# EAGLE schematic CoPro2019 (EAGLE 9.1.3)
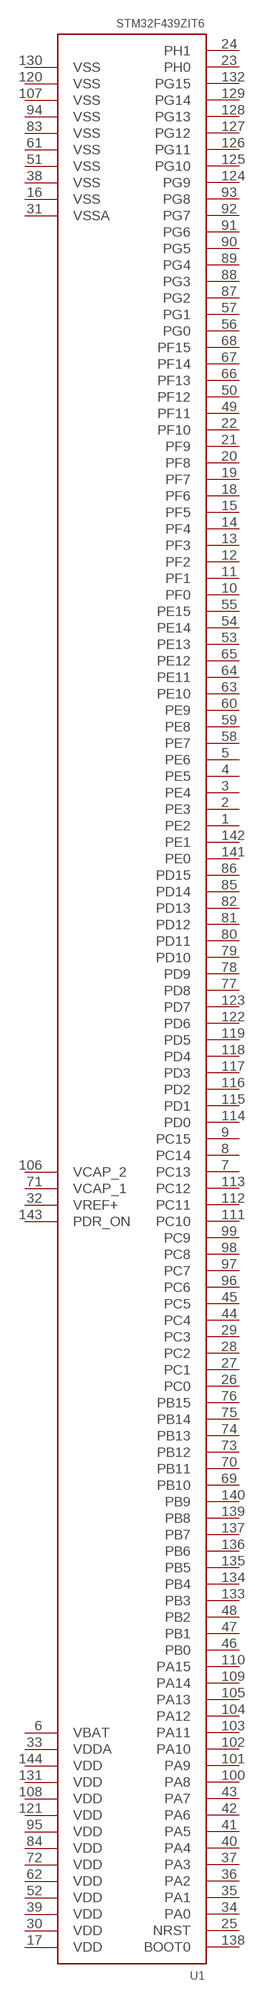
[diagram p0: schematic, sheet 1]

## Parts
U1  STM32F439ZIT6  [QFP50P2200X2200X160-144N]
Unconnected: U1.1(PE2) U1.2(PE3) U1.3(PE4) U1.4(PE5) U1.5(PE6) U1.7(PC13) U1.8(PC14) U1.9(PC15) U1.10(PF0) U1.11(PF1) U1.12(PF2) U1.13(PF3) U1.14(PF4) U1.15(PF5) U1.18(PF6) U1.19(PF7) U1.20(PF8) U1.21(PF9) U1.22(PF10) U1.23(PH0) U1.24(PH1) U1.25(NRST) U1.26(PC0) U1.27(PC1) U1.28(PC2) U1.29(PC3) U1.34(PA0) U1.35(PA1) U1.36(PA2) U1.37(PA3) U1.40(PA4) U1.41(PA5) U1.42(PA6) U1.43(PA7) U1.44(PC4) U1.45(PC5) U1.46(PB0) U1.47(PB1) U1.48(PB2) U1.49(PF11) U1.50(PF12) U1.53(PE13) U1.54(PE14) U1.55(PE15) U1.56(PG0) U1.57(PG1) U1.58(PE7) U1.59(PE8) U1.60(PE9) U1.63(PE10) U1.64(PE11) U1.65(PE12) U1.66(PF13) U1.67(PF14) U1.68(PF15) U1.69(PB10) U1.70(PB11) U1.73(PB12) U1.74(PB13) U1.75(PB14) U1.76(PB15) U1.77(PD8) U1.78(PD9) U1.79(PD10) U1.80(PD11) U1.81(PD12) U1.82(PD13) U1.85(PD14) U1.86(PD15) U1.87(PG2) U1.88(PG3) U1.89(PG4) U1.90(PG5) U1.91(PG6) U1.92(PG7) U1.93(PG8) U1.96(PC6) U1.97(PC7) U1.98(PC8) U1.99(PC9) U1.100(PA8) U1.101(PA9) U1.102(PA10) U1.103(PA11) U1.104(PA12) U1.105(PA13) U1.109(PA14) U1.110(PA15) U1.111(PC10) U1.112(PC11) U1.113(PC12) U1.114(PD0) U1.115(PD1) U1.116(PD2) U1.117(PD3) U1.118(PD4) U1.119(PD5) U1.122(PD6) U1.123(PD7) U1.124(PG9) U1.125(PG10) U1.126(PG11) U1.127(PG12) U1.128(PG13) U1.129(PG14) U1.132(PG15) U1.133(PB3) U1.134(PB4) U1.135(PB5) U1.136(PB6) U1.137(PB7) U1.138(BOOT0) U1.139(PB8) U1.140(PB9) U1.141(PE0) U1.142(PE1)

## Power pins joined to a net without a drawn wire
PDR_ON: U1.143(PDR_ON)
VBAT: U1.6(VBAT)
VCAP_1: U1.71(VCAP_1)
VCAP_2: U1.106(VCAP_2)
VDD: U1.17(VDD) U1.30(VDD) U1.39(VDD) U1.52(VDD) U1.62(VDD) U1.72(VDD) U1.84(VDD) U1.95(VDD) U1.108(VDD) U1.121(VDD) U1.131(VDD) U1.144(VDD)
VDDA: U1.33(VDDA)
VREF+: U1.32(VREF+)
VSS: U1.16(VSS) U1.38(VSS) U1.51(VSS) U1.61(VSS) U1.83(VSS) U1.94(VSS) U1.107(VSS) U1.120(VSS) U1.130(VSS)
VSSA: U1.31(VSSA)

## Library data of the parts
U1 = STM32F439ZIT6:STM32F439ZIT6: MCU 32-bit STM32F ARM Cortex M4 RISC 2048KB Flash 2.5V/3.3V 144-Pin LQFP Tray; AVAILABILITY: Unavailable; DESCRIPTION: MCU 32-bit STM32F ARM Cortex M4 RISC 2048KB Flash 2.5V/3.3V 144-Pin LQFP Tray; MF: STMicroelectronics; MP: STM32F439ZIT6; PACKAGE: LQFP-144 STMicroelectronics; PRICE: None